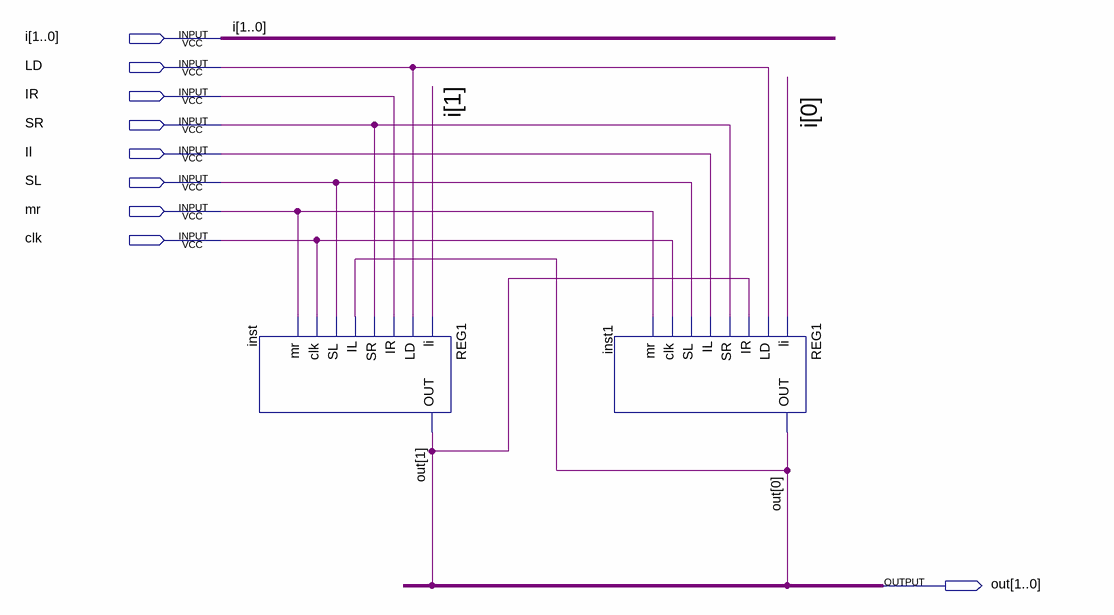
[diagram p0: schematic sheet]
// Quartus schematic REG2.bdf as structural Verilog: 2 symbols, 9 pins
module REG2 (
  input  [1:0] i,
  input  LD,
  input  IR,
  input  SR,
  input  Il,
  input  SL,
  input  mr,
  input  clk,
  output [1:0] out
);

  REG1 inst (.li(i[1]), .LD(LD), .IR(IR), .SR(SR), .IL(out[0]), .SL(SL), .clk(clk), .mr(mr), .OUT(out[1]));
  REG1 inst1 (.li(i[0]), .LD(LD), .IR(out[1]), .SR(SR), .IL(Il), .SL(SL), .clk(clk), .mr(mr), .OUT(out[0]));
endmodule
